# Altium schematic sheet TestLEDs.SchDoc
size A4
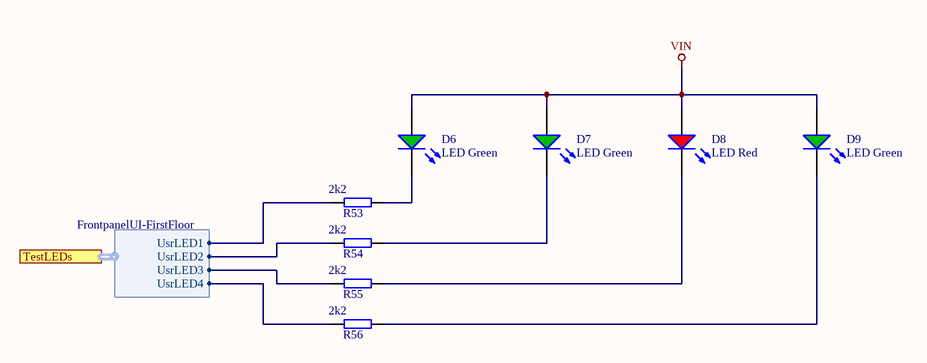
[diagram p0: TestLEDs.SchDoc]

## Parts
D6  LED Green  [WL-SMCW_0603]
D7  LED Green  [WL-SMCW_0603]
D8  LED Red  [WL-SMCW_0603]
D9  LED Green  [WL-SMCW_0603]
R53  2k2  [R_1206_TE]
R54  2k2  [R_1206_TE]
R55  2k2  [R_1206_TE]
R56  2k2  [R_1206_TE]

## Ports
TestLEDs (harness FrontpanelUI-FirstFloor)

## Harnesses
FrontpanelUI-FirstFloor: UsrLED1, UsrLED2, UsrLED3, UsrLED4

## Nets
VIN: D6.2(A) D7.2(A) D8.2(A) D9.2(A)
NetD6_1: D6.1(K) R53.2
NetD7_1: D7.1(K) R54.2
NetD8_1: D8.1(K) R55.2
NetD9_1: D9.1(K) R56.2
NetR53_1: R53.1 ; port TestLEDs.UsrLED1
NetR54_1: R54.1 ; port TestLEDs.UsrLED2
NetR55_1: R55.1 ; port TestLEDs.UsrLED3
NetR56_1: R56.1 ; port TestLEDs.UsrLED4

## Notes on the sheet
- Title
- Revision:
- Design Engineer:
- Date:
- Project:
- Sheet
- of

## Library data of the parts
D6 D7 D9 = UZgen_LED_0603_Green: Standard LEDs - SMD 0603 green; Manufacturer: UZgen; Created from: UZgenTool; Manufacturer Part Number: UZgen_LED_0603_Green; PartID: 21; Created On: 09/09/2024 10:45:01; ComponentLink1Description: N/A; ComponentLink1URL: N/A; Component Type: LED Diode; Device Package: 0603; Last Updated: 09/09/2024 10:45:01; Mounting Type: SMD; Supplier 1: LCSC; Supplier Part Number 1: =LCSC Part Number; Type: Standard; Live Cycle Status: 1; Stock number: not stored; Color: green; Value: LED Green
D8 = UZgen_LED_0603_Red: Standard LEDs - SMD 0603 red; Manufacturer: UZgen; Created from: UZgenTool; Manufacturer Part Number: UZgen_LED_0603_Red; PartID: 22; Created On: 09/09/2024 10:45:01; ComponentLink1Description: N/A; ComponentLink1URL: N/A; Component Type: LED Diode; Device Package: 0603; Last Updated: 09/09/2024 10:45:01; Mounting Type: SMD; Supplier 1: LCSC; Supplier Part Number 1: =LCSC Part Number; Type: Standard; Live Cycle Status: 1; Stock number: not stored; Color: red; Value: LED Red
R53-R56 = UZgen_R_1206_2k2: Generic resistor; Manufacturer: UZgen; Tolerance: 1 %; Created from: UZgenTool; Manufacturer Part Number: UZgen_R_1206_2k2; PartID: 516; Created On: 02/07/2024 17:29:56; Value: 2k2; Device Package: 1206; Mounting Type: SMD; Last Updated: 02/07/2024 17:29:56